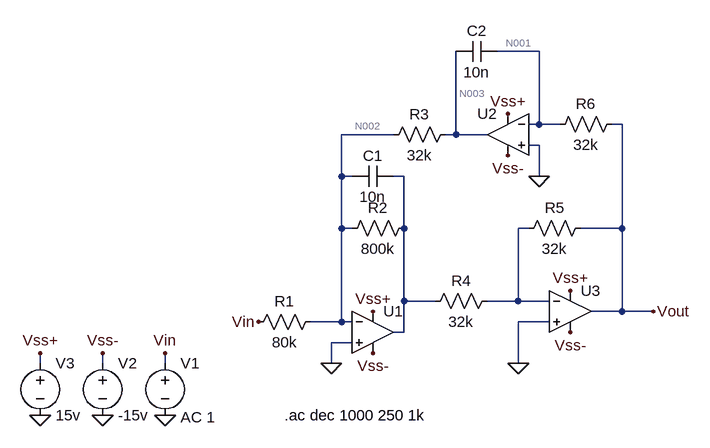
[diagram p0: schematic Biquad_Band_Pass.asc]
Biquad_Band_Pass.asc, the LTspice schematic file:
Version 4
SHEET 1 1064 680
WIRE 512 -368 448 -368
WIRE 512 -256 512 -368
WIRE 512 -256 496 -256
WIRE 544 -256 512 -256
WIRE 640 -256 624 -256
WIRE 288 -240 208 -240
WIRE 384 -240 384 -368
WIRE 384 -240 368 -240
WIRE 432 -240 384 -240
WIRE 512 -224 496 -224
WIRE 208 -176 208 -240
WIRE 224 -176 208 -176
WIRE 304 -176 288 -176
WIRE 512 -176 512 -224
WIRE 208 -96 208 -176
WIRE 224 -96 208 -96
WIRE 304 -96 304 -176
WIRE 496 -96 480 -96
WIRE 640 -96 640 -256
WIRE 640 -96 576 -96
WIRE 304 16 304 -96
WIRE 352 16 304 16
WIRE 480 16 480 -96
WIRE 480 16 432 16
WIRE 528 16 480 16
WIRE 640 32 640 -96
WIRE 640 32 592 32
WIRE 688 32 640 32
WIRE 208 48 208 -96
WIRE 208 48 160 48
WIRE 224 48 208 48
WIRE 528 48 480 48
WIRE 304 64 304 16
WIRE 304 64 288 64
WIRE 224 80 192 80
WIRE -256 112 -256 96
WIRE -160 112 -160 96
WIRE -64 112 -64 96
WIRE 192 112 192 80
WIRE 480 112 480 48
FLAG -64 192 0
FLAG 688 32 Vout
FLAG -64 96 Vin
FLAG -160 192 0
FLAG -256 192 0
FLAG -256 96 Vss+
FLAG -160 96 Vss-
FLAG 256 96 Vss-
FLAG 256 32 Vss+
FLAG 464 -272 Vss+
FLAG 464 -208 Vss-
FLAG 560 64 Vss-
FLAG 560 0 Vss+
FLAG 80 48 Vin
FLAG 192 112 0
FLAG 480 112 0
FLAG 512 -176 0
SYMBOL res 176 32 R90
WINDOW 0 0 56 VBottom 2
WINDOW 3 32 56 VTop 2
SYMATTR InstName R1
SYMATTR Value 80k
SYMBOL res 320 -112 R90
WINDOW 0 0 56 VBottom 2
WINDOW 3 32 56 VTop 2
SYMATTR InstName R2
SYMATTR Value 800k
SYMBOL res 448 0 R90
WINDOW 0 0 56 VBottom 2
WINDOW 3 32 56 VTop 2
SYMATTR InstName R4
SYMATTR Value 32k
SYMBOL res 384 -256 R90
WINDOW 0 0 56 VBottom 2
WINDOW 3 32 56 VTop 2
SYMATTR InstName R3
SYMATTR Value 32k
SYMBOL OpAmps\\UniversalOpAmp 464 -240 M0
SYMATTR InstName U2
SYMBOL voltage -64 96 R0
WINDOW 123 24 99 Left 2
WINDOW 39 0 0 Left 0
SYMATTR Value2 AC 1
SYMATTR InstName V1
SYMATTR Value ""
SYMBOL voltage -160 96 R0
WINDOW 123 0 0 Left 0
WINDOW 39 0 0 Left 0
SYMATTR InstName V2
SYMATTR Value -15v
SYMBOL voltage -256 96 R0
WINDOW 123 0 0 Left 0
WINDOW 39 0 0 Left 0
SYMATTR InstName V3
SYMATTR Value 15v
SYMBOL cap 448 -384 R90
WINDOW 0 0 32 VBottom 2
WINDOW 3 32 32 VTop 2
SYMATTR InstName C2
SYMATTR Value 10n
SYMBOL OpAmps\\UniversalOpAmp 256 64 R0
SYMATTR InstName U1
SYMBOL res 592 -112 R90
WINDOW 0 0 56 VBottom 2
WINDOW 3 32 56 VTop 2
SYMATTR InstName R5
SYMATTR Value 32k
SYMBOL OpAmps\\UniversalOpAmp 560 32 R0
SYMATTR InstName U3
SYMBOL cap 288 -192 R90
WINDOW 0 0 32 VBottom 2
WINDOW 3 32 32 VTop 2
SYMATTR InstName C1
SYMATTR Value 10n
SYMBOL res 640 -272 R90
WINDOW 0 0 56 VBottom 2
WINDOW 3 32 56 VTop 2
SYMATTR InstName R6
SYMATTR Value 32k
TEXT 120 192 Left 2 !.ac dec 1000 250 1k

The netlist it stands for:
* Biquad_Band_Pass.asc
R1 N002 Vin 80k
R2 N004 N002 800k
R4 N005 N004 32k
R3 N003 N002 32k
XU2 0 N001 Vss+ Vss- N003 level1 Avol=1Meg GBW=10Meg Vos=0 En=0 Enk=0 In=0 Ink=0 Rin=500Meg  ; pins In+ In- V+ V- OUT
V1 Vin 0 AC 1
V2 Vss- 0 -15v
V3 Vss+ 0 15v
C2 N001 N003 10n
XU1 0 N002 Vss+ Vss- N004 level1 Avol=1Meg GBW=10Meg Vos=0 En=0 Enk=0 In=0 Ink=0 Rin=500Meg  ; pins In+ In- V+ V- OUT
R5 Vout N005 32k
XU3 0 N005 Vss+ Vss- Vout level1 Avol=1Meg GBW=10Meg Vos=0 En=0 Enk=0 In=0 Ink=0 Rin=500Meg  ; pins In+ In- V+ V- OUT
C1 N004 N002 10n
R6 Vout N001 32k
.ac dec 1000 250 1k
.lib UniversalOpAmp1.lib
.backanno
.end

* Results of the author's LTspice run, read from the files saved beside the schematic
* Operating Point, zero values left out:
*   V(vss+) = 15 V
*   V(vss-) = -15 V
*   I(V3) = -90 nA
*   I(V2) = 90 nA
*   Ix(u2:3) = 30 nA
*   Ix(u2:4) = -30 nA
*   Ix(u1:3) = 30 nA
*   Ix(u1:4) = -30 nA
*   Ix(u3:3) = 30 nA
*   Ix(u3:4) = -30 nA
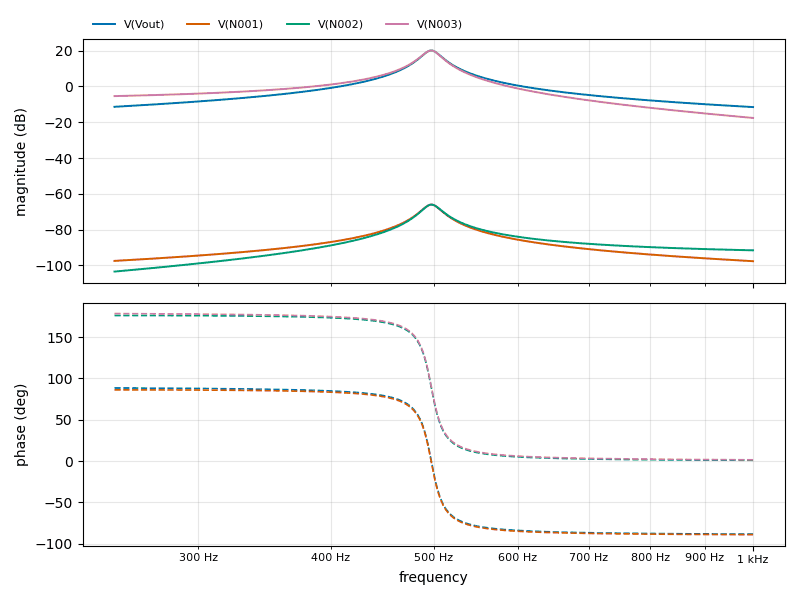
[diagram p1: AC Analysis of Biquad_Band_Pass.asc, plotted from the saved traces]
* AC Analysis, 1 run:
*   V(Vout): -11.41 dB at 250 Hz, -11.56 dB at 1 kHz, peak 20.04 dB at 497.7 Hz, 3 dB below the peak at 487.5 Hz and 507.3 Hz
*   V(N001): -97.47 dB at 250 Hz, -97.63 dB at 1 kHz, peak -66.03 dB at 497.7 Hz, 3 dB below the peak at 487.5 Hz and 507.3 Hz
*   V(N002): -103.44 dB at 250 Hz, -91.56 dB at 1 kHz, peak -66.02 dB at 497.7 Hz, 3 dB below the peak at 487.9 Hz and 507.7 Hz
*   V(N003): -5.43 dB at 250 Hz, -17.63 dB at 1 kHz, peak 20.03 dB at 497.7 Hz, 3 dB below the peak at 487.1 Hz and 507 Hz